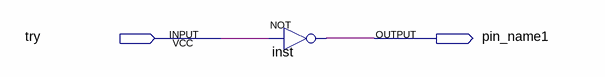
[diagram p0: schematic sheet]
// Quartus schematic hgh2.bdf as structural Verilog: 1 symbols, 2 pins
module hgh2 (
  input  try,
  output pin_name1
);

  not inst (pin_name1, try);
endmodule
